# EAGLE design pov (EAGLE 9.6.2)
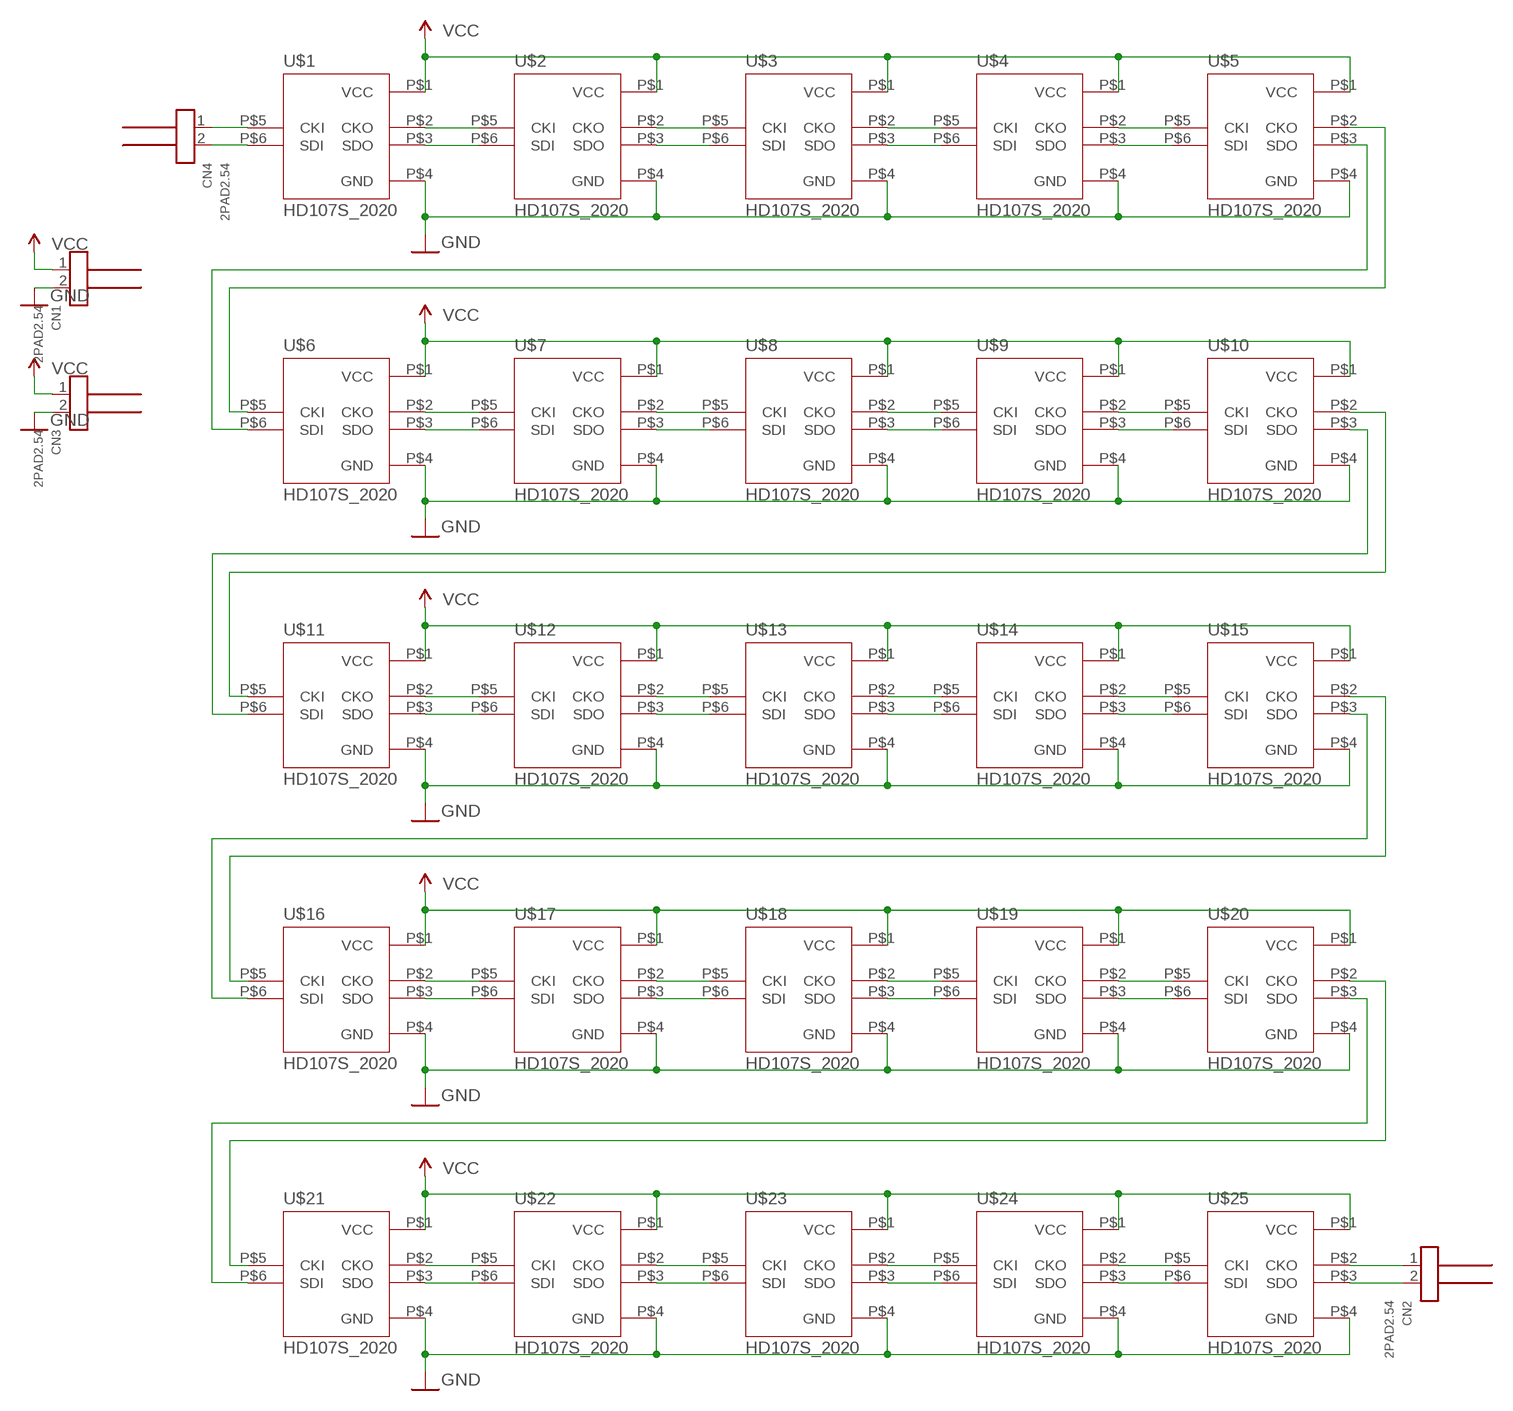
[diagram p0: schematic, sheet 1]

## Parts
CN1  2PAD2.54  [2POLE_P2.54]
CN2  2PAD2.54  [2POLE_P2.54]
CN3  2PAD2.54  [2POLE_P2.54]
CN4  2PAD2.54  [2POLE_P2.54]
U$1  HD107S_2020  [HD107S_2020_FOOTPRINT]
U$2  HD107S_2020  [HD107S_2020_FOOTPRINT]
U$3  HD107S_2020  [HD107S_2020_FOOTPRINT]
U$4  HD107S_2020  [HD107S_2020_FOOTPRINT]
U$5  HD107S_2020  [HD107S_2020_FOOTPRINT]
U$6  HD107S_2020  [HD107S_2020_FOOTPRINT]
U$7  HD107S_2020  [HD107S_2020_FOOTPRINT]
U$8  HD107S_2020  [HD107S_2020_FOOTPRINT]
U$9  HD107S_2020  [HD107S_2020_FOOTPRINT]
U$10  HD107S_2020  [HD107S_2020_FOOTPRINT]
U$11  HD107S_2020  [HD107S_2020_FOOTPRINT]
U$12  HD107S_2020  [HD107S_2020_FOOTPRINT]
U$13  HD107S_2020  [HD107S_2020_FOOTPRINT]
U$14  HD107S_2020  [HD107S_2020_FOOTPRINT]
U$15  HD107S_2020  [HD107S_2020_FOOTPRINT]
U$16  HD107S_2020  [HD107S_2020_FOOTPRINT]
U$17  HD107S_2020  [HD107S_2020_FOOTPRINT]
U$18  HD107S_2020  [HD107S_2020_FOOTPRINT]
U$19  HD107S_2020  [HD107S_2020_FOOTPRINT]
U$20  HD107S_2020  [HD107S_2020_FOOTPRINT]
U$21  HD107S_2020  [HD107S_2020_FOOTPRINT]
U$22  HD107S_2020  [HD107S_2020_FOOTPRINT]
U$23  HD107S_2020  [HD107S_2020_FOOTPRINT]
U$24  HD107S_2020  [HD107S_2020_FOOTPRINT]
U$25  HD107S_2020  [HD107S_2020_FOOTPRINT]

## Nets
GND [gnd]: CN1.2 CN3.2 U$1.P$4(GND) U$2.P$4(GND) U$3.P$4(GND) U$4.P$4(GND) U$5.P$4(GND) U$6.P$4(GND) U$7.P$4(GND) U$8.P$4(GND) U$9.P$4(GND) U$10.P$4(GND) U$11.P$4(GND) U$12.P$4(GND) U$13.P$4(GND) U$14.P$4(GND) U$15.P$4(GND) U$16.P$4(GND) U$17.P$4(GND) U$18.P$4(GND) U$19.P$4(GND) U$20.P$4(GND) U$21.P$4(GND) U$22.P$4(GND) U$23.P$4(GND) U$24.P$4(GND) U$25.P$4(GND)
N$1 [line]: U$1.P$2(CKO) U$2.P$5(CKI)
N$2 [line]: U$1.P$3(SDO) U$2.P$6(SDI)
N$3 [line]: U$2.P$2(CKO) U$3.P$5(CKI)
N$4 [line]: U$2.P$3(SDO) U$3.P$6(SDI)
N$5 [line]: U$3.P$2(CKO) U$4.P$5(CKI)
N$6 [line]: U$3.P$3(SDO) U$4.P$6(SDI)
N$7 [line]: U$4.P$2(CKO) U$5.P$5(CKI)
N$8 [line]: U$4.P$3(SDO) U$5.P$6(SDI)
N$9 [line]: U$6.P$2(CKO) U$7.P$5(CKI)
N$10 [line]: U$6.P$3(SDO) U$7.P$6(SDI)
N$11 [line]: U$7.P$2(CKO) U$8.P$5(CKI)
N$12 [line]: U$7.P$3(SDO) U$8.P$6(SDI)
N$13 [line]: U$8.P$2(CKO) U$9.P$5(CKI)
N$14 [line]: U$8.P$3(SDO) U$9.P$6(SDI)
N$15 [line]: U$9.P$2(CKO) U$10.P$5(CKI)
N$16 [line]: U$9.P$3(SDO) U$10.P$6(SDI)
N$17 [line]: U$10.P$3(SDO) U$11.P$6(SDI)
N$18 [line]: U$10.P$2(CKO) U$11.P$5(CKI)
N$19 [line]: U$11.P$2(CKO) U$12.P$5(CKI)
N$20 [line]: U$11.P$3(SDO) U$12.P$6(SDI)
N$21 [line]: U$5.P$3(SDO) U$6.P$6(SDI)
N$22 [line]: CN4.1 U$1.P$5(CKI)
N$23 [line]: U$12.P$2(CKO) U$13.P$5(CKI)
N$24 [line]: U$12.P$3(SDO) U$13.P$6(SDI)
N$25 [line]: U$13.P$2(CKO) U$14.P$5(CKI)
N$26 [line]: U$13.P$3(SDO) U$14.P$6(SDI)
N$27 [line]: U$14.P$2(CKO) U$15.P$5(CKI)
N$28 [line]: U$14.P$3(SDO) U$15.P$6(SDI)
N$29 [line]: U$15.P$3(SDO) U$16.P$6(SDI)
N$30 [line]: U$15.P$2(CKO) U$16.P$5(CKI)
N$31 [line]: U$16.P$2(CKO) U$17.P$5(CKI)
N$32 [line]: U$16.P$3(SDO) U$17.P$6(SDI)
N$33 [line]: U$17.P$2(CKO) U$18.P$5(CKI)
N$34 [line]: U$17.P$3(SDO) U$18.P$6(SDI)
N$35 [line]: U$18.P$2(CKO) U$19.P$5(CKI)
N$36 [line]: U$18.P$3(SDO) U$19.P$6(SDI)
N$37 [line]: U$19.P$2(CKO) U$20.P$5(CKI)
N$38 [line]: U$19.P$3(SDO) U$20.P$6(SDI)
N$39 [line]: U$20.P$3(SDO) U$21.P$6(SDI)
N$40 [line]: U$20.P$2(CKO) U$21.P$5(CKI)
N$41 [line]: U$21.P$2(CKO) U$22.P$5(CKI)
N$42 [line]: U$21.P$3(SDO) U$22.P$6(SDI)
N$43 [line]: U$22.P$2(CKO) U$23.P$5(CKI)
N$44 [line]: U$22.P$3(SDO) U$23.P$6(SDI)
N$45 [line]: U$23.P$2(CKO) U$24.P$5(CKI)
N$46 [line]: U$23.P$3(SDO) U$24.P$6(SDI)
N$47 [line]: U$24.P$2(CKO) U$25.P$5(CKI)
N$48 [line]: U$24.P$3(SDO) U$25.P$6(SDI)
N$49 [line]: CN2.2 U$25.P$3(SDO)
N$50 [line]: CN2.1 U$25.P$2(CKO)
N$51 [line]: U$5.P$2(CKO) U$6.P$5(CKI)
N$52 [line]: CN4.2 U$1.P$6(SDI)
VCC [vcc]: CN1.1 CN3.1 U$1.P$1(VCC) U$2.P$1(VCC) U$3.P$1(VCC) U$4.P$1(VCC) U$5.P$1(VCC) U$6.P$1(VCC) U$7.P$1(VCC) U$8.P$1(VCC) U$9.P$1(VCC) U$10.P$1(VCC) U$11.P$1(VCC) U$12.P$1(VCC) U$13.P$1(VCC) U$14.P$1(VCC) U$15.P$1(VCC) U$16.P$1(VCC) U$17.P$1(VCC) U$18.P$1(VCC) U$19.P$1(VCC) U$20.P$1(VCC) U$21.P$1(VCC) U$22.P$1(VCC) U$23.P$1(VCC) U$24.P$1(VCC) U$25.P$1(VCC)

## Library data of the parts
CN1-CN4 = Pad:2PAD
U$1-U$25 = HD107S:HD107S_2020

## Net classes
1 vcc: width 0.75 mm
2 gnd: width 0.5 mm
3 line: width 0.3 mm

## Board
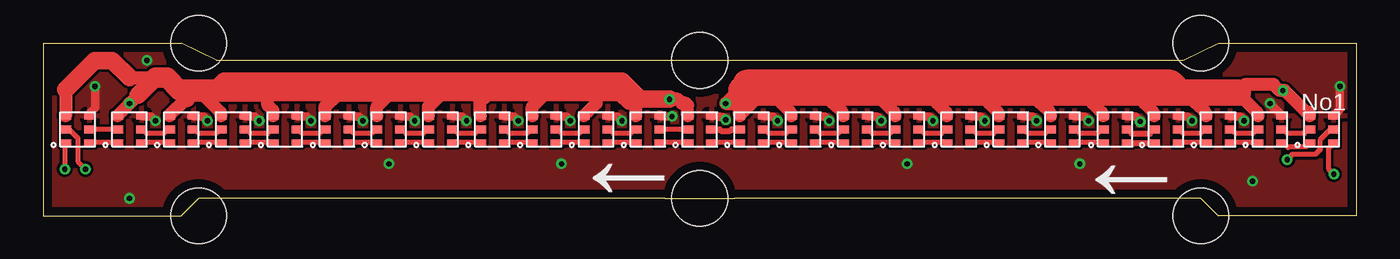
[diagram p1: board, top side]
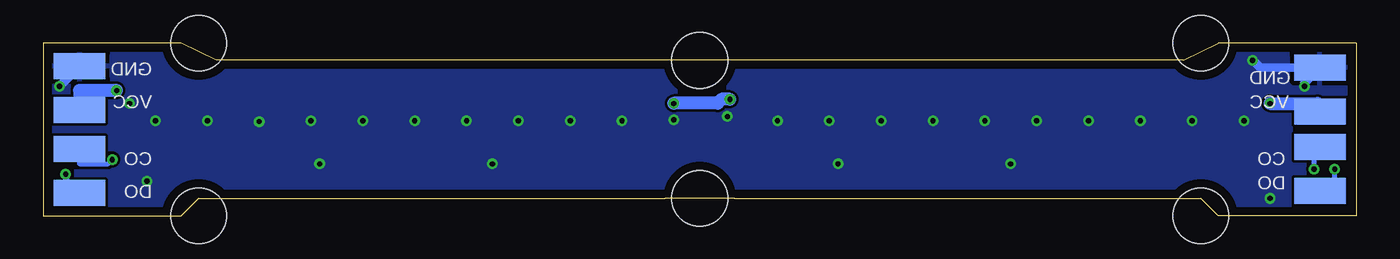
[diagram p2: board, bottom side, seen from below]

Size 76 x 10 mm. Coordinates in mm from the lower left corner, seen from the top.
Outline: 0,10 8,10 10,9 66,9 68,10 76,10 76,0 68,0 67,1 40,1 36,1 9,1 8,0 0,0 0,10
Copper layers (1*16): Top 0.035mm / dielectric 1.6mm / Bottom 0.035mm
Design rules "Elecrow_2-layer_PCB_eagle_rule": minimum track width 6mil, minimum drill 12mil, track to track 6mil, track to pad 6mil, pad to pad 6mil, via to via 8mil, smd to smd 0mil, copper to edge 20mil, drill to drill 10mil, minimum pad ring 6mil, minimum via ring 6mil, stop-mask expansion 0mil, vias tented up to drill 100mil, thermal gap 10mil
Holes 3.2 mm at 38,9 38,1 9,0 9,10 67,10 67,0

### Footprints (pad centres in the part's own frame; a part is rotated, then mirrored left to right if it is on the bottom)
2POLE_P2.54 = smd 1.5 x 3: 1 1.27,0; 2 -1.27,0
HD107S_2020_FOOTPRINT = smd 0.65 x 0.45: P$1 0.3,1.8; P$2 0.3,1; P$3 0.3,0.2; P$4 1.7,1.8; P$5 1.7,1; P$6 1.7,0.2

### Placement (x,y rotation side)
CN1  2.1,7.3 270 bottom
CN2  2.1,2.7 90 bottom
CN3  73.9,7.4 270 bottom
CN4  73.9,2.6 90 bottom
U$1  73,4 0 top
U$2  70,4 0 top
U$3  67,4 0 top
U$4  64,4 0 top
U$5  61.05,4 0 top
U$6  58,4 0 top
U$7  55,4 0 top
U$8  52,4 0 top
U$9  49,4 0 top
U$10  46,4 0 top
U$11  43,4 0 top
U$12  40,4 0 top
U$13  37,4 0 top
U$14  34,4 0 top
U$15  31,4 0 top
U$16  28,4 0 top
U$17  25,4 0 top
U$18  22,4 0 top
U$19  19,4 0 top
U$20  16,4 0 top
U$21  13,4 0 top
U$22  10,4 0 top
U$23  7,4 0 top
U$24  4,4 0 top
U$25  1,4 0 top

### Tracks (layer width: path | path; a pad name or v marks a point on that pad's centre or on a via)
GND  (via drill 0.3)
  Top 0.5: v3,7.5 3,6.25 2.75,6 U$25.P$4 | v6.5,5.5 6.25,5.75 5.75,5.75 U$24.P$4 | v9.5,5.5 9.25,5.75 8.75,5.75 U$23.P$4 | v12.5,5.5 12.25,5.75 11.75,5.75 U$22.P$4 | v15.5,5.5 15.25,5.75 14.75,5.75 U$21.P$4 | v18.5,5.5 18.25,5.75 17.75,5.75 U$20.P$4 | v21.5,5.5 21.25,5.75 20.75,5.75 U$19.P$4 | v24.5,5.5 24.25,5.75 23.75,5.75 U$18.P$4 | v27.5,5.5 27.25,5.75 26.75,5.75 U$17.P$4 | v30.5,5.5 30.25,5.75 29.75,5.75 U$16.P$4 | U$15.P$4 32.75,5.75 33.25,5.75 v33.5,5.5 | v36.4,5.75 35.75,5.75 U$14.P$4 | 38.75,5.75 U$13.P$4 | v42.5,5.5 42.25,5.75 41.75,5.75 U$12.P$4 | v45.5,5.5 45.25,5.75 44.75,5.75 U$11.P$4 | v48.5,5.5 48.25,5.75 47.75,5.75 U$10.P$4 | v51.5,5.5 51.25,5.75 50.75,5.75 U$9.P$4 | v54.5,5.5 54.25,5.75 53.75,5.75 U$8.P$4 | v57.5,5.5 57.25,5.75 56.75,5.75 U$7.P$4 | v60.5,5.5 60.25,5.75 59.75,5.75 U$6.P$4 | v63.5,5.45 63.5,5.5 63.25,5.75 62.75,5.75 U$5.P$4 | v66.5,5.5 66.25,5.75 65.75,5.75 U$4.P$4 | v69.5,5.5 69.25,5.75 68.75,5.75 U$3.P$4 | 39.15,5.75 39.18,5.72 39.33,5.72 v39.5,5.55 | v75.05,7.5 75.05,6.15 U$1.P$4 | U$2.P$4 v71,6.5
  Bottom 0.5: CN3.2 75.05,7.52 v75.05,7.5 | v3,7.5 3,7.67 CN1.2 5.57,8.57 v6,9
  other vias: 5,1 20,3 30,3 50,3 60,3 70,2
  pour Bottom: 0,10 0,0 76,0 76,10
  pour Top: 0,10 0,0 76,0 76,10
N$1
  Top 0.3: U$2.P$5 71.75,5 72,4.75 73,4.75 73.25,5 U$1.P$2
N$2
  Top 0.3: U$2.P$6 71.75,4.25 72.06,3.95 72.11,4 73.1,4 U$1.P$3
N$3
  Top 0.3: U$3.P$5 68.75,5 69,4.75 70,4.75 70.25,5 U$2.P$2
N$4
  Top 0.3: U$3.P$6 68.75,4.25 70.25,4.25 U$2.P$3
N$5
  Top 0.3: U$4.P$5 65.75,5 66,4.75 67,4.75 67.25,5 U$3.P$2
N$6
  Top 0.3: U$4.P$6 65.75,4.25 67.25,4.25 U$3.P$3
N$7
  Top 0.35: U$5.P$5 63,4.75 64.05,4.75 U$4.P$2
N$8
  Top 0.35: U$5.P$6 U$4.P$3
N$9
  Top 0.3: U$7.P$5 56.75,5 57,4.75 58,4.75 58.25,5 U$6.P$2
N$10
  Top 0.3: U$7.P$6 56.75,4.25 58.25,4.25 U$6.P$3
N$11
  Top 0.3: U$8.P$5 53.75,5 54,4.75 55,4.75 55.25,5 U$7.P$2
N$12
  Top 0.3: U$8.P$6 53.75,4.25 55.25,4.25 U$7.P$3
N$13
  Top 0.3: U$9.P$5 50.75,5 51,4.75 52,4.75 52.25,5 U$8.P$2
N$14
  Top 0.3: U$9.P$6 50.75,4.25 52.25,4.25 U$8.P$3
N$15
  Top 0.3: U$10.P$5 47.75,5 48,4.75 49,4.75 49.25,5 U$9.P$2
N$16
  Top 0.3: U$10.P$6 47.75,4.25 49.25,4.25 U$9.P$3
N$17
  Top 0.3: U$11.P$6 44.75,4.25 46.25,4.25 U$10.P$3
N$18
  Top 0.3: U$11.P$5 44.75,5 45,4.75 46,4.75 46.25,5 U$10.P$2
N$19
  Top 0.3: U$12.P$5 41.75,5 42,4.75 43,4.75 43.25,5 U$11.P$2
N$20
  Top 0.3: U$12.P$6 41.75,4.25 43.25,4.25 U$11.P$3
N$21
  Top 0.3: U$6.P$6 59.75,4.25 61,4.25 61.25,4.25 U$5.P$3
N$22  (via drill 0.3)
  Top 0.3: U$1.P$5 74.5,5 73.93,4.43 73.93,3.85 73.63,3.55 72.3,3.55 v72,3.25
  Bottom 0.3: v72,3.25 72.25,3 73.9,3 CN4.1
N$23
  Top 0.35: U$13.P$5 39.16,5 39.24,4.92 39.76,4.92 39.84,5 U$12.P$2
N$24
  Top 0.3: U$13.P$6 38.75,4.25 40.25,4.25 U$12.P$3
N$25
  Top 0.3: U$13.P$2 U$14.P$5
N$26
  Top 0.3: U$14.P$6 35.75,4.25 37.25,4.25 U$13.P$3
N$27
  Top 0.3: U$15.P$5 32.75,5 33,4.75 34,4.75 34.25,5 U$14.P$2
N$28
  Top 0.3: U$15.P$6 32.75,4.25 34.25,4.25 U$14.P$3
N$29
  Top 0.3: U$16.P$6 29.75,4.25 31.25,4.25 U$15.P$3
N$30
  Top 0.3: U$16.P$5 29.75,5 30,4.75 31,4.75 31.25,5 U$15.P$2
N$31
  Top 0.3: U$17.P$5 26.75,5 27,4.75 28,4.75 28.25,5 U$16.P$2
N$32
  Top 0.3: U$17.P$6 26.75,4.25 28.25,4.25 U$16.P$3
N$33
  Top 0.3: U$18.P$5 23.75,5 24,4.75 25,4.75 25.25,5 U$17.P$2
N$34
  Top 0.3: U$18.P$6 23.75,4.25 25.25,4.25 U$17.P$3
N$35
  Top 0.3: U$19.P$5 20.75,5 21,4.75 22,4.75 22.25,5 U$18.P$2
N$36
  Top 0.3: U$19.P$6 20.75,4.25 22.25,4.25 U$18.P$3
N$37
  Top 0.3: U$20.P$5 17.75,5 18,4.75 19,4.75 19.25,5 U$19.P$2
N$38
  Top 0.3: U$20.P$6 17.75,4.25 19.25,4.25 U$19.P$3
N$39
  Top 0.3: U$21.P$6 14.75,4.25 16.25,4.25 U$20.P$3
N$40
  Top 0.3: U$21.P$5 14.75,5 15,4.75 16,4.75 16.25,5 U$20.P$2
N$41
  Top 0.3: U$22.P$5 11.75,5 12,4.75 13,4.75 13.25,5 U$21.P$2
N$42
  Top 0.3: U$22.P$6 11.75,4.25 13.25,4.25 U$21.P$3
N$43
  Top 0.3: U$23.P$5 8.75,5 9,4.75 10,4.75 10.25,5 U$22.P$2
N$44
  Top 0.3: U$23.P$6 8.75,4.25 10.25,4.25 U$22.P$3
N$45
  Top 0.3: U$24.P$5 5.75,5 6,4.75 7,4.75 7.25,5 U$23.P$2
N$46
  Top 0.3: U$24.P$6 5.75,4.25 7.25,4.25 U$23.P$3
N$47
  Top 0.3: U$24.P$2 U$25.P$5
N$48
  Top 0.3: U$25.P$6 2.75,4.25 4.25,4.25 U$24.P$3
N$49  (via drill 0.3)
  Top 0.3: U$25.P$3 1.25,4.15 v1.25,2.7
  Bottom 0.3: v1.25,2.7 1.25,1.25 2.1,1.25 CN2.2
N$50  (via drill 0.3)
  Top 0.3: U$25.P$2 1.5,5 2,4.5 2,3.15 v2.45,2.7
  Bottom 0.3: v2.45,2.7 2.45,3.75 2.1,3.75 CN2.1
N$51
  Top 0.3: U$6.P$5 59.75,5 60,4.75 61,4.75 61.25,5 U$5.P$2
N$52  (via drill 0.3)
  Top 0.3: U$1.P$6 74.38,3.88 74.38,2.72 v74.7,2.4
  Bottom 0.3: v74.7,2.4 74.7,2.13 CN4.2
VCC  (via drill 0.3)
  Top 0.75: 42.75,6.5 43.25,6 U$11.P$1 | 42.75,6.5 42.5,6.75 41.25,6.75 U$12.P$1 40.3,6.3 40.1,6.5 v39.5,6.5 40.3,7.3 | 45.75,6.5 45.5,6.75 43,6.75 42.75,6.5 | 45.75,6.5 46.25,6 U$10.P$1 | 48.75,6.5 48.5,6.75 46,6.75 45.75,6.5 | 48.75,6.5 49.25,6 U$9.P$1 | 51.75,6.5 51.5,6.75 49,6.75 48.75,6.5 | 51.75,6.5 52.25,6 U$8.P$1 | 54.75,6.5 54.5,6.75 52,6.75 51.75,6.5 | 54.75,6.5 55.25,6 U$7.P$1 | 57.75,6.5 57.5,6.75 55,6.75 54.75,6.5 | 57.75,6.5 58.25,6 U$6.P$1 | 60.75,6.5 60.5,6.75 58,6.75 57.75,6.5 | 60.75,6.5 61.25,6 U$5.P$1 | 63.75,6.5 63.5,6.75 61,6.75 60.75,6.5 | 63.75,6.5 64.25,6 U$4.P$1 | 66.75,6.5 66.5,6.75 64,6.75 63.75,6.5 | 66.75,6.5 67.25,6 U$3.P$1 | U$2.P$1 70.25,6 69.5,6.75 67,6.75 66.75,6.5 | 73.25,6 U$1.P$1 71.85,7.25 v71.75,7.25 71.55,7.25 71.2,7.6 69.6,7.6 69.14,7.14 | 5.5,7 v5,6.5 U$24.P$1 | U$22.P$1 10.25,6 9.25,7 | 9.25,7 13,7 | 17,7 13,7 | 17,7 20,7 | 20,7 23,7 | 32,7 33.4,7 33.9,6.5 | 32,7 29,7 | 29,7 25.7,7 | 25.7,7 23,7 | 9.25,7 8.3,7 8.3,6.8 U$23.P$1 | U$21.P$1 13.3,6.1 13,6.4 13,7 | v36.25,6.75 36.74,6.75 36.97,6.52 37.18,6.52 37.3,6.4 U$13.P$1 | 1.3,7.3 U$25.P$1 | 5,8 6.5,8 | 17,7 16.3,6.3 U$20.P$1 | U$19.P$1 19.3,6.3 20,7 | U$18.P$1 22.3,6.3 23,7 | U$17.P$1 25.3,6.6 25.7,7 | U$15.P$1 32,6.5 32,7 | U$16.P$1 28.3,6.3 29,7 | U$14.P$1 34.3,6.5 34.55,6.75
  Top 1: 5,8 4,8.99 2.99,8.99 1.3,7.3 | 6.5,8 6.51,8 6.5,8 5.5,7 | 8.3,6.8 8.3,6.87 7.88,7.29 7.98,7.39 10.08,7.39 10.49,7.8 33.5,7.8 34.55,6.75 v36.25,6.75 35.25,6.75
  Top 1.2: 6.51,8 7.17,8 7.88,7.29
  Top 1.3: 40.7,7.7 40.3,7.3 40.3,7
  Top 1.5: 69.14,7.14 65.82,7.14 65.26,7.7 40.7,7.7
  Bottom 0.75: v71.75,7.25 73.9,7.25 CN3.1 | v5,6.5 2.25,6.5 2.1,6.35 CN1.1 | v36.25,6.75 36.74,6.75 36.97,6.52 39.48,6.52 v39.5,6.5

### Text on the board
tPlace: No1 | ← | ←
bPlace: GND | GND | VCC | VCC | CO | CO | DO | DO